# EAGLE board csa_bios_v3.0d (EAGLE 4.15)
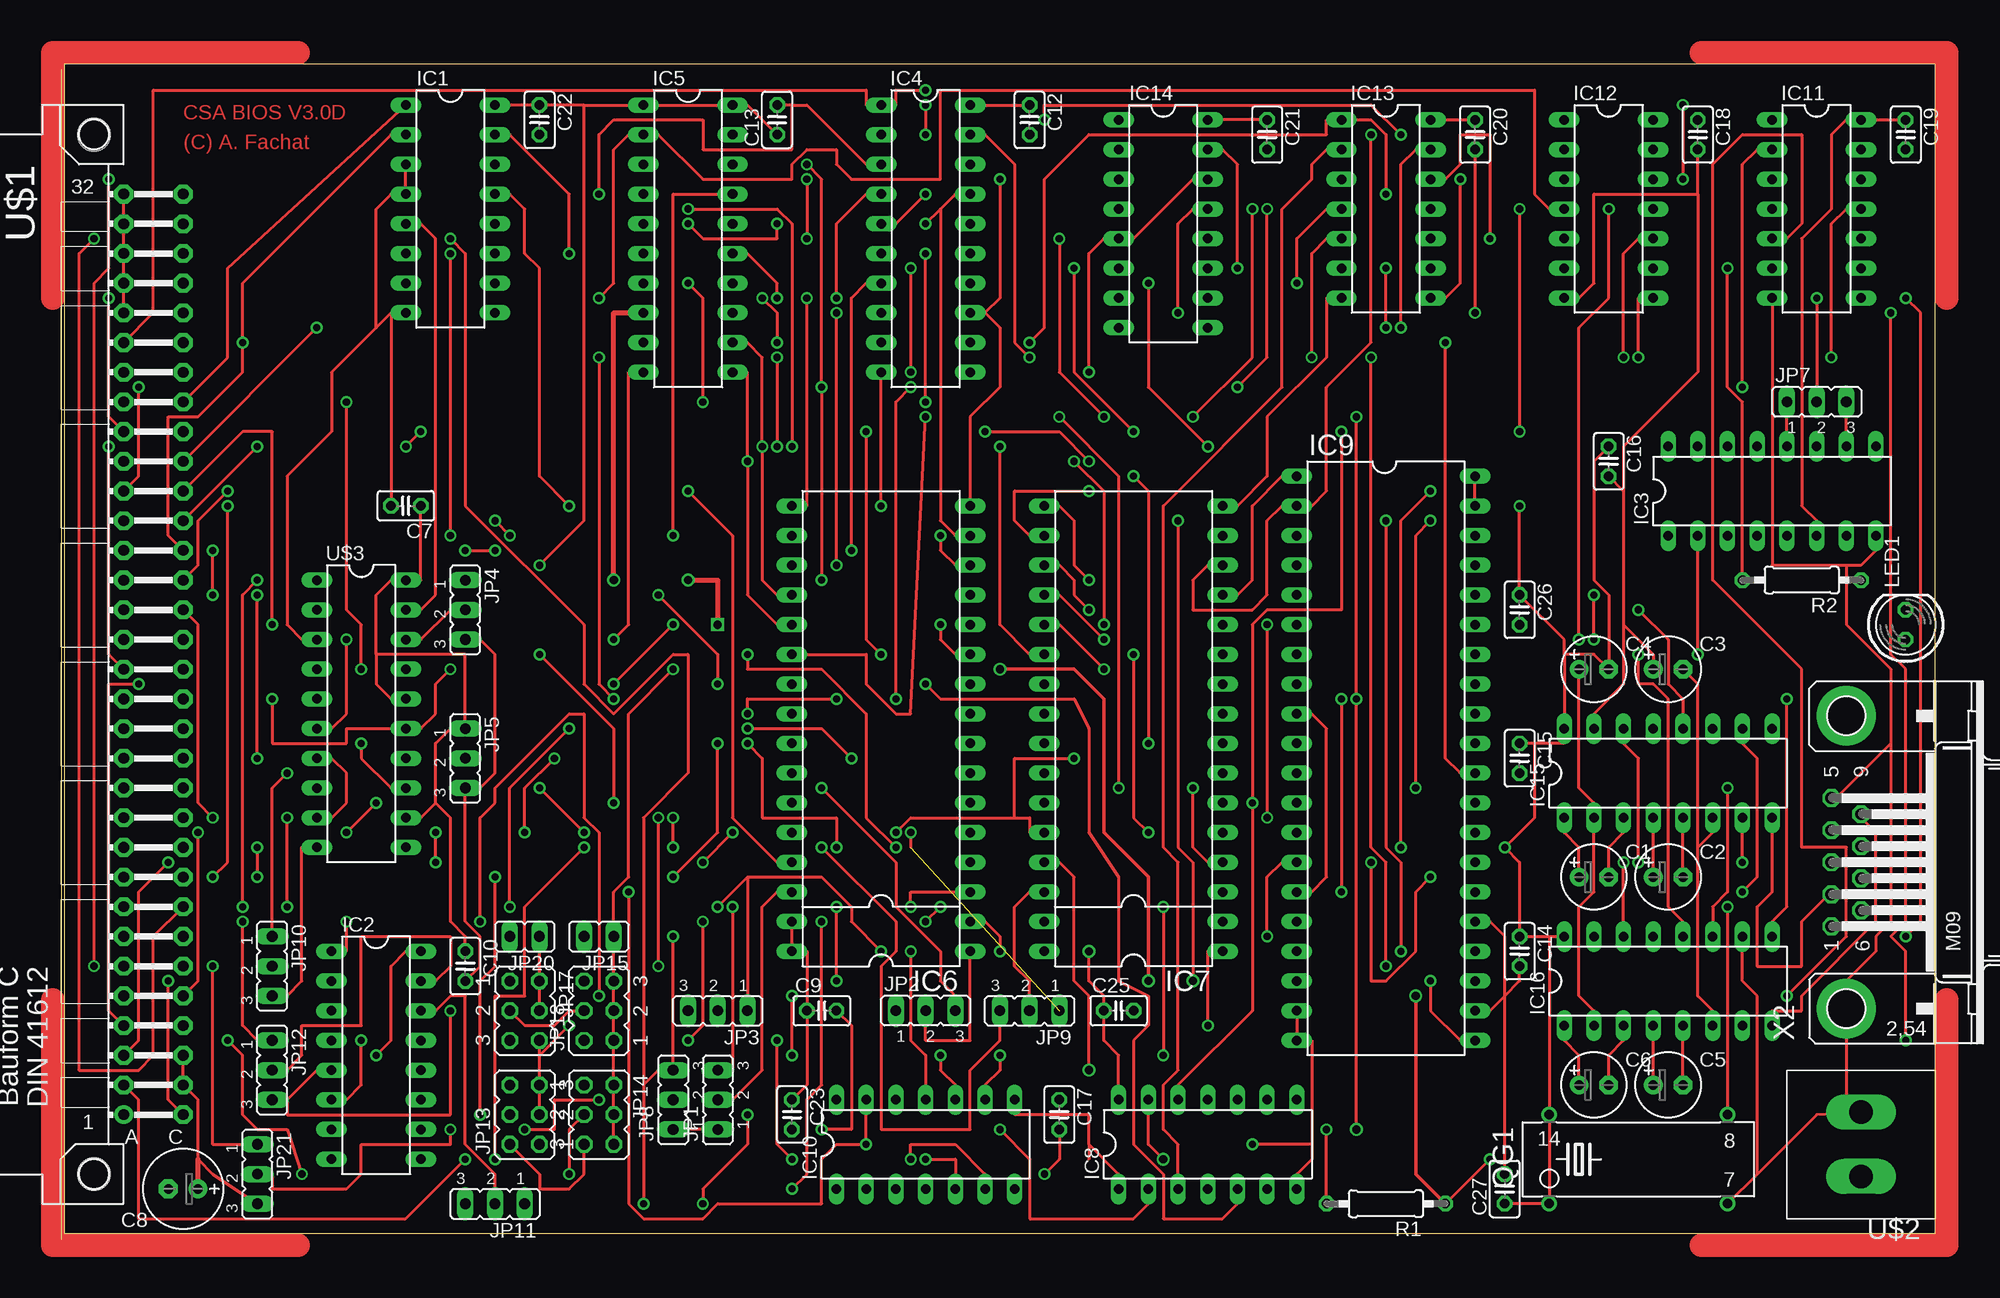
[diagram p2: board, top side]
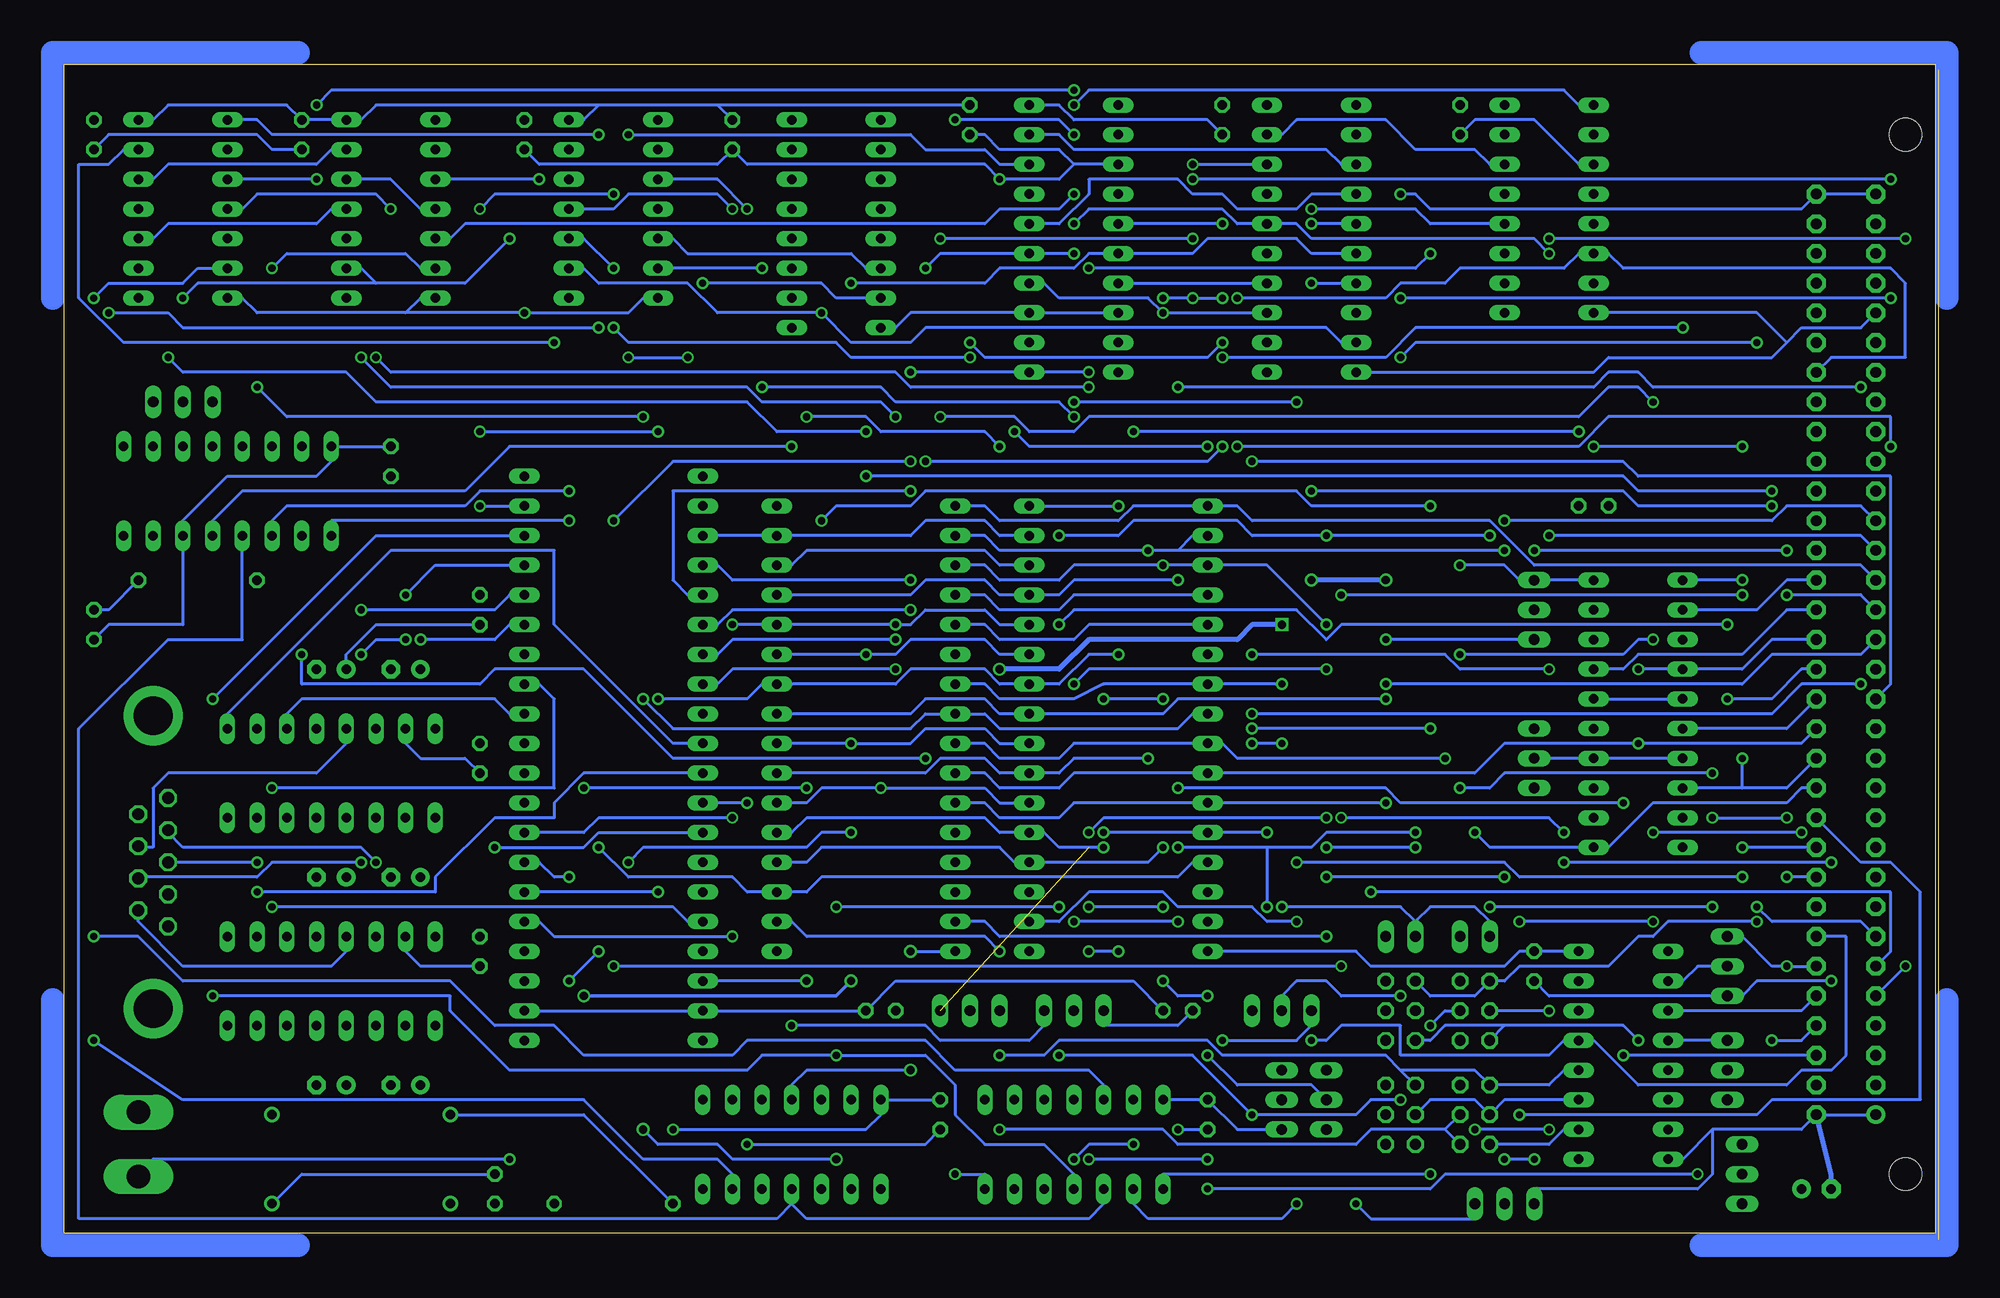
[diagram p3: board, bottom side, seen from below]

Size 160 x 100 mm. Coordinates in mm from the lower left corner, seen from the top.
Outline: 0,0 160,0 160,100 0,100 0,0
Copper layers (1*16): Top 0.035mm / dielectric 1.5mm / Bottom 0.035mm
Design rules "default": minimum track width 10mil, minimum drill 24mil, track to track 8mil, track to pad 8mil, pad to pad 8mil, via to via 8mil, smd to smd 8mil, copper to edge 40mil, drill to drill 8mil, minimum pad ring 10mil, minimum via ring 8mil, stop-mask expansion 4mil, vias tented up to drill 0mil, thermal gap 10mil

## Footprints (pad centres in the part's own frame; a part is rotated, then mirrored left to right if it is on the bottom)
E2,5-6 = drill 0.813 pad 1.6 round: + -1.27,0 | drill 0.813 pad 1.6 octagon: - 1.27,0
C025-025X050 = drill 0.813 octagon: 1 -1.27,0; 2 1.27,0
E2,5-7 = drill 0.813 pad 1.6 round: + -1.27,0 | drill 0.813 pad 1.6 octagon: - 1.27,0
DIL16 = drill 0.813 long: 1 -8.89,-3.81; 2 -6.35,-3.81; 3 -3.81,-3.81; 4 -1.27,-3.81; 5 1.27,-3.81; 6 3.81,-3.81; 7 6.35,-3.81; 8 8.89,-3.81; 9 8.89,3.81; 10 6.35,3.81; 11 3.81,3.81; 12 1.27,3.81; 13 -1.27,3.81; 14 -3.81,3.81; 15 -6.35,3.81; 16 -8.89,3.81
DIL20 = drill 0.813 long: 1 -10.16,-3.81; 2 -7.62,-3.81; 3 -5.08,-3.81; 4 -2.54,-3.81; 5 0,-3.81; 6 2.54,-3.81; 7 5.08,-3.81; 8 7.62,-3.81; 9 10.16,-3.81; 10 12.7,-3.81; 11 12.7,3.81; 12 10.16,3.81; 13 7.62,3.81; 14 5.08,3.81; 15 2.54,3.81; 16 0,3.81; 17 -2.54,3.81; 18 -5.08,3.81; 19 -7.62,3.81; 20 -10.16,3.81
DIL20' = drill 0.813 long: 1 -11.43,-3.81; 2 -8.89,-3.81; 3 -6.35,-3.81; 4 -3.81,-3.81; 5 -1.27,-3.81; 6 1.27,-3.81; 7 3.81,-3.81; 8 6.35,-3.81; 9 8.89,-3.81; 10 11.43,-3.81; 11 11.43,3.81; 12 8.89,3.81; 13 6.35,3.81; 14 3.81,3.81; 15 1.27,3.81; 16 -1.27,3.81; 17 -3.81,3.81; 18 -6.35,3.81; 19 -8.89,3.81; 20 -11.43,3.81
DIL32OPT28 = drill 0.813 long: 1 -19.05,-7.62; 2 -16.51,-7.62; 3 -13.97,-7.62; 4 -11.43,-7.62; 5 -8.89,-7.62; 6 -6.35,-7.62; 7 -3.81,-7.62; 8 -1.27,-7.62; 9 1.27,-7.62; 10 3.81,-7.62; 11 6.35,-7.62; 12 8.89,-7.62; 13 11.43,-7.62; 14 13.97,-7.62; 15 16.51,-7.62; 16 19.05,-7.62; 17 19.05,7.62; 18 16.51,7.62; 19 13.97,7.62; 20 11.43,7.62; 21 8.89,7.62; 22 6.35,7.62; 23 3.81,7.62; 24 1.27,7.62; 25 -1.27,7.62; 26 -3.81,7.62; 27 -6.35,7.62; 28 -8.89,7.62; 29 -11.43,7.62; 30 -13.97,7.62; 31 -16.51,7.62; 32 -19.05,7.62
DIL14 = drill 0.813 long: 1 -7.62,-3.81; 2 -5.08,-3.81; 3 -2.54,-3.81; 4 0,-3.81; 5 2.54,-3.81; 6 5.08,-3.81; 7 7.62,-3.81; 8 7.62,3.81; 9 5.08,3.81; 10 2.54,3.81; 11 0,3.81; 12 -2.54,3.81; 13 -5.08,3.81; 14 -7.62,3.81
DIL40 = drill 0.813 long: 1 -16.51,-7.62; 2 -13.97,-7.62; 3 -11.43,-7.62; 4 -8.89,-7.62; 5 -6.35,-7.62; 6 -3.81,-7.62; 7 -1.27,-7.62; 8 1.27,-7.62; 9 3.81,-7.62; 10 6.35,-7.62; 11 8.89,-7.62; 12 11.43,-7.62; 13 13.97,-7.62; 14 16.51,-7.62; 15 19.05,-7.62; 16 21.59,-7.62; 17 24.13,-7.62; 18 26.67,-7.62; 19 29.21,-7.62; 20 31.75,-7.62; 21 31.75,7.62; 22 29.21,7.62; 23 26.67,7.62; 24 24.13,7.62; 25 21.59,7.62; 26 19.05,7.62; 27 16.51,7.62; 28 13.97,7.62; 29 11.43,7.62; 30 8.89,7.62; 31 6.35,7.62; 32 3.81,7.62; 33 1.27,7.62; 34 -1.27,7.62; 35 -3.81,7.62; 36 -6.35,7.62; 37 -8.89,7.62; 38 -11.43,7.62; 39 -13.97,7.62; 40 -16.51,7.62
JP2 = drill 0.914 long: 1 -2.54,0; 2 0,0; 3 2.54,0
JP3Q = drill 0.914 octagon: 1 -2.54,-1.27; 2 -2.54,1.27; 3 0,-1.27; 4 0,1.27; 5 2.54,-1.27; 6 2.54,1.27
JP1 = drill 0.914 long: 1 0,-1.27; 2 0,1.27
LED5MM = drill 0.813 octagon: A -1.27,0; K 1.27,0
SG51 = drill 0.813 round: 1 -7.62,-3.81; 7 7.62,-3.81; 8 7.62,3.81; 14 -7.62,3.81
0207/10 = drill 0.813 octagon: 1 -5.08,0; 2 5.08,0
CSABUS = drill 0.914 pad 1.6 round: A1 7.62,36.83 | drill 0.914 pad 1.6 octagon: A2 7.62,34.29; A3 7.62,31.75; A4 7.62,29.21; A5 7.62,26.67; A6 7.62,24.13; A7 7.62,21.59; A8 7.62,19.05; A9 7.62,16.51; A10 7.62,13.97; A11 7.62,11.43; A12 7.62,8.89; A13 7.62,6.35; A14 7.62,3.81; A15 7.62,1.27; A16 7.62,-1.27; A17 7.62,-3.81; A18 7.62,-6.35; A19 7.62,-8.89; A20 7.62,-11.43; A21 7.62,-13.97; A22 7.62,-16.51; A23 7.62,-19.05; A24 7.62,-21.59; A25 7.62,-24.13; A26 7.62,-26.67; A27 7.62,-29.21; A28 7.62,-31.75; A29 7.62,-34.29; A30 7.62,-36.83; A31 7.62,-39.37; A32 7.62,-41.91; C1 2.54,36.83; C2 2.54,34.29; C3 2.54,31.75; C4 2.54,29.21; C5 2.54,26.67; C6 2.54,24.13; C7 2.54,21.59; C8 2.54,19.05; C9 2.54,16.51; C10 2.54,13.97; C11 2.54,11.43; C12 2.54,8.89; C13 2.54,6.35; C14 2.54,3.81; C15 2.54,1.27; C16 2.54,-1.27; C17 2.54,-3.81; C18 2.54,-6.35; C19 2.54,-8.89; C20 2.54,-11.43; C21 2.54,-13.97; C22 2.54,-16.51; C23 2.54,-19.05; C24 2.54,-21.59; C25 2.54,-24.13; C26 2.54,-26.67; C27 2.54,-29.21; C28 2.54,-31.75; C29 2.54,-34.29; C30 2.54,-36.83; C31 2.54,-39.37; C32 2.54,-41.91 | hole 2.794: 10.16,41.91; 10.16,-46.99
TASTER = drill 2.007 long: 1 0,4.013; 3 0,-1.473
M09HP = drill 1.016 octagon: 1 -5.486,1.27; 2 -2.743,1.27; 3 0,1.27; 4 2.743,1.27; 5 5.486,1.27; 6 -4.115,-1.27; 7 -1.372,-1.27; 8 1.372,-1.27; 9 4.115,-1.27 | drill 3.302 pad 5.08 round: G1 -12.522,0; G2 12.522,0

## Placement (x,y rotation side)
C1  1u  [E2,5-6]  130.81,30.48 0 top
C2  1u  [E2,5-6]  137.16,30.48 0 top
C3  4u7  [E2,5-6]  137.16,48.26 0 top
C4  4u7  [E2,5-6]  130.81,48.26 0 top
C5  1u  [E2,5-6]  137.16,12.7 0 top
C6  1u  [E2,5-6]  130.81,12.7 0 top
C7  [C025-025X050]  29.21,62.23 180 top
C8  47u  [E2,5-7]  10.16,3.81 180 top
C9  [C025-025X050]  64.77,19.05 0 top
C10  [C025-025X050]  34.29,22.86 270 top
C12  [C025-025X050]  82.55,95.25 270 top
C13  [C025-025X050]  60.96,95.25 90 top
C14  [C025-025X050]  124.46,24.13 270 top
C15  [C025-025X050]  124.46,40.64 270 top
C16  [C025-025X050]  132.08,66.04 270 top
C17  [C025-025X050]  85.09,10.16 270 top
C18  [C025-025X050]  139.7,93.98 270 top
C19  [C025-025X050]  157.48,93.98 270 top
C20  [C025-025X050]  120.65,93.98 270 top
C21  [C025-025X050]  102.87,93.98 270 top
C22  [C025-025X050]  40.64,95.25 270 top
C23  [C025-025X050]  62.23,10.16 270 top
C25  [C025-025X050]  90.17,19.05 0 top
C26  [C025-025X050]  124.46,53.34 270 top
C27  [C025-025X050]  123.19,3.81 90 top
IC1  74HC138N  [DIL16]  33.02,87.63 270 top
IC2  74LS139N  [DIL16]  26.67,15.24 270 top
IC3  74HC138N  [DIL16]  146.05,63.5 0 top
IC4  74LS273BUSOPT  [DIL20]  73.66,86.36 270 top
IC5  74HCT245N  [DIL20']  53.34,85.09 270 top
IC6  ROMSOCK32TO512K  [DIL32OPT28]  69.85,43.18 90 top
IC7  RAMSOCK32TO512K  [DIL32OPT28]  91.44,43.18 90 top
IC8  74HCT00N  [DIL14]  97.79,7.62 0 top
IC9  UART  [DIL40]  113.03,48.26 270 top
IC10  74LS32N  [DIL14]  73.66,7.62 0 top
IC11  74LS04N  [DIL14]  149.86,87.63 270 top
IC12  74LS07N  [DIL14]  132.08,87.63 270 top
IC13  74HCT00N  [DIL14]  113.03,87.63 270 top
IC14  74LS279N  [DIL16]  93.98,86.36 270 top
IC15  MAX232  [DIL16]  137.16,39.37 0 top
IC16  MAX232  [DIL16]  137.16,21.59 0 top
JP1  [JP2]  55.88,11.43 90 top
JP2  [JP2]  73.66,19.05 0 top
JP3  [JP2]  55.88,19.05 180 top
JP4  [JP2]  34.29,53.34 270 top
JP5  [JP2]  34.29,40.64 270 top
JP7  [JP2]  149.86,71.12 0 top
JP8  [JP2]  52.07,11.43 90 top
JP9  [JP2]  82.55,19.05 180 top
JP10  [JP2]  17.78,22.86 270 top
JP11  [JP2]  36.83,2.54 180 top
JP12  [JP2]  17.78,13.97 270 top
JP13  [JP3Q]  39.37,10.16 90 top
JP14  [JP3Q]  45.72,10.16 270 top
JP15  [JP1]  45.72,25.4 90 top
JP17  [JP3Q]  39.37,19.05 270 top
JP18  [JP3Q]  45.72,19.05 90 top
JP20  [JP1]  39.37,25.4 90 top
JP21  [JP2]  16.51,5.08 270 top
LED1  [LED5MM]  157.48,52.07 90 top
QG1  1,8432MHz  [SG51]  134.62,6.35 0 top
R1  4k7  [0207/10]  113.03,2.54 180 top
R2  220  [0207/10]  148.59,55.88 180 top
U$1  CSABUS  [CSABUS]  12.7,46.99 180 top
U$2  TASTER  [TASTER]  153.67,8.89 180 top
U$3  74LS688BUSOPT  [DIL20]  25.4,45.72 270 top
X2  [M09HP]  152.4,31.75 90 top

## Tracks (layer width: path | path; a pad name or v marks a point on that pad's centre or on a via)
50HZ  (via drill 0.61)
  Top 0.254: U$1.A3 6.35,16.51 6.35,29.21 v8.89,31.75 | v31.75,31.75 v31.75,34.29 | v50.8,35.56 v50.8,22.86 | v113.03,22.86 113.03,31.75 111.76,33.02 v111.76,74.93 | v106.68,74.93 106.68,83.82 107.95,85.09 IC13.5
  Bottom 0.254: IC14.6 91.44,82.55 92.71,83.82 106.68,83.82 107.95,85.09 IC13.5 | v8.89,31.75 v31.75,31.75 | v31.75,34.29 33.02,35.56 v50.8,35.56 | v50.8,22.86 v113.03,22.86 | v111.76,74.93 v106.68,74.93
/CTRLR
  Bottom 0.254: IC1.14 38.1,91.44 39.37,92.71 44.45,92.71 46.99,95.25 54.61,95.25 55.88,93.98 IC5.19
/CTRLW  (via drill 0.61)
  Top 0.254: IC14.14 96.52,90.17 91.44,85.09 IC14.5 88.9,85.09 87.63,83.82 v87.63,73.66 | v43.18,83.82 43.18,88.9 38.1,93.98 IC1.15 | v72.39,82.55 v72.39,73.66
  Bottom 0.254: v43.18,83.82 44.45,82.55 v72.39,82.55 | v72.39,73.66 IC4.11 v87.63,73.66
/EXTIO  (via drill 0.61)
  Top 0.254: v134.62,74.93 134.62,80.01 IC12.8 | v88.9,69.85 85.09,73.66 v85.09,85.09 | v63.5,90.17 v63.5,85.09 | v2.54,22.86 2.54,81.28 3.81,82.55 v3.81,90.17
  Bottom 0.254: v134.62,74.93 132.08,72.39 101.6,72.39 100.33,71.12 90.17,71.12 v88.9,69.85 | v63.5,85.09 v85.09,85.09 | v3.81,90.17 v63.5,90.17 | U$1.A5 v2.54,22.86
/EXTIOEN  (via drill 0.61)
  Top 0.254: v97.79,67.31 92.71,72.39 v92.71,81.28
  Bottom 0.254: IC5.6 53.34,83.82 54.61,85.09 62.23,85.09 63.5,83.82 IC4.6 72.39,83.82 73.66,82.55 80.01,82.55 81.28,81.28 v92.71,81.28 | v97.79,67.31 121.92,67.31 125.73,63.5 144.78,63.5 147.32,60.96 IC3.5
/IOINH  (via drill 0.61)
  Top 0.254: v133.35,74.93 133.35,83.82 134.62,85.09 IC12.10 | v72.39,72.39 71.12,71.12 v71.12,45.72 | v66.04,45.72 58.42,45.72 v58.42,44.45 | v6.35,46.99 3.81,46.99 3.81,19.05 U$1.A4
  Bottom 0.254: v133.35,74.93 132.08,73.66 88.9,73.66 87.63,72.39 v72.39,72.39 | v66.04,45.72 v71.12,45.72 | v58.42,44.45 13.97,44.45 11.43,46.99 v6.35,46.99
/IOSEL  (via drill 0.61)
  Top 0.254: v16.51,55.88 15.24,54.61 v15.24,27.94
  Bottom 0.254: v15.24,27.94 13.97,26.67 6.35,26.67 U$1.A7 | v16.51,55.88 U$3.1
/IRQ  (via drill 0.61)
  Top 0.254: IC12.4 127,87.63 125.73,88.9 125.73,97.79 74.93,97.79 74.93,90.17 67.31,90.17 66.04,91.44 66.04,92.71 63.5,92.71 62.23,91.44 62.23,90.17 54.61,90.17 50.8,93.98 IC5.2 48.26,93.98 46.99,92.71 46.99,81.28 v45.72,80.01 | U$1.A24 3.81,69.85 v3.81,80.01
  Bottom 0.254: IC12.12 132.08,90.17 129.54,87.63 IC12.4 | v3.81,80.01 v45.72,80.01
/MEMSEL  (via drill 0.61)
  Top 0.254: v73.66,6.35 76.2,6.35 IC10.5 | IC10.13 v68.58,7.62 66.04,7.62 64.77,6.35 64.77,2.54 55.88,2.54 54.61,1.27 49.53,1.27 48.26,2.54 v48.26,29.21
  Bottom 0.254: v68.58,7.62 72.39,7.62 v73.66,6.35 | U$1.A6 3.81,24.13 3.81,29.21 v48.26,29.21
/RAM  (via drill 0.61)
  Top 0.254: JP17.4 JP17.2 JP20.1 | v80.01,8.89 82.55,6.35 82.55,1.27 91.44,1.27 92.71,2.54 IC8.2 | JP13.3 JP13.5 40.64,15.24 | 40.64,15.24 JP17.6 | 40.64,15.24 v43.18,17.78
  Bottom 0.254: v80.01,8.89 66.04,8.89 64.77,7.62 49.53,7.62 48.26,8.89 41.91,8.89 | 41.91,8.89 JP13.3 | JP13.1 41.91,8.89 | JP17.4 41.91,19.05 v43.18,17.78
/RAMSEL  (via drill 0.61)
  Top 0.254: v73.66,69.85 72.39,44.45 71.12,44.45 68.58,46.99 68.58,49.53 IC6.22 | v100.33,72.39 102.87,74.93 v102.87,87.63
  Bottom 0.254: v73.66,69.85 74.93,71.12 88.9,71.12 90.17,72.39 v100.33,72.39 | v102.87,87.63 104.14,88.9 111.76,88.9 113.03,87.63 IC13.11
/RES  (via drill 0.61)
  Top 0.254: v138.43,96.52 v138.43,90.17 | v73.66,97.79 71.12,97.79 71.12,96.52 IC4.1 68.58,96.52 68.58,97.79 7.62,97.79 7.62,78.74 U$1.A27
  Bottom 0.254: v138.43,96.52 137.16,97.79 v73.66,97.79 | v138.43,90.17 IC11.3
/ROM  (via drill 0.61)
  Top 0.254: JP14.6 JP14.4 JP14.2 JP18.1 JP18.3 JP18.5 JP15.1 46.99,29.21 48.26,30.48 48.26,44.45 v52.07,48.26 | v73.66,46.99 74.93,45.72 86.36,45.72 87.63,43.18 87.63,34.29 90.17,30.48 90.17,21.59 92.71,20.32 92.71,17.78 91.44,16.51 91.44,7.62 93.98,5.08 93.98,1.27 99.06,1.27 100.33,2.54 IC8.5
  Bottom 0.254: v73.66,46.99 72.39,48.26 v52.07,48.26
/UARTRD  (via drill 0.61)
  Top 0.254: v116.84,21.59 116.84,19.05 119.38,16.51 IC9.21 | v113.03,60.96 113.03,33.02 114.3,31.75 v114.3,24.13 | v87.63,66.04 85.09,68.58 v78.74,68.58 | v62.23,67.31 62.23,86.36 60.96,87.63 v53.34,87.63
  Bottom 0.254: v114.3,24.13 v116.84,21.59 | v113.03,60.96 107.95,66.04 v87.63,66.04 | v78.74,68.58 77.47,67.31 v62.23,67.31 | v53.34,87.63 44.45,87.63 43.18,86.36 IC1.12
/UARTWR  (via drill 0.61, 0.7)
  Top 0.254: v96.52,21.59 96.52,31.75 95.25,33.02 v95.25,60.96 | v43.18,62.23 40.64,64.77 40.64,82.55 39.37,83.82 39.37,87.63 38.1,88.9 IC1.13
  Bottom 0.254: v95.25,60.96 93.98,62.23 87.63,62.23 86.36,63.5 54.61,63.5 53.34,62.23 v43.18,62.23 | v96.52,21.59 IC9.18
BUSA0  (via drill 0.61)
  Top 0.254: v102.87,52.07 v102.87,35.56 | U$1.C23 v21.59,77.47 | v60.96,74.93 v60.96,67.31 | v86.36,66.04 88.9,63.5 v88.9,52.07
  Bottom 0.254: IC6.12 80.01,52.07 81.28,53.34 86.36,53.34 87.63,52.07 v88.9,52.07 IC7.12 v102.87,52.07 | v102.87,35.56 114.3,35.56 115.57,34.29 IC9.28 | v21.59,77.47 44.45,77.47 46.99,74.93 v60.96,74.93 | v60.96,67.31 62.23,66.04 v86.36,66.04
BUSA1  (via drill 0.61)
  Top 0.254: v116.84,30.48 115.57,29.21 115.57,24.13 113.03,21.59 111.76,21.59 v111.76,31.75 | v92.71,34.29 91.44,35.56 v91.44,49.53 | U$1.C22 15.24,68.58 17.78,68.58 v17.78,52.07 | v74.93,52.07 74.93,50.8 76.2,49.53 IC6.11
  Bottom 0.254: IC6.11 80.01,49.53 81.28,50.8 87.63,50.8 88.9,49.53 v91.44,49.53 IC7.11 | v116.84,30.48 118.11,30.48 119.38,31.75 IC9.27 | v111.76,31.75 110.49,33.02 96.52,33.02 95.25,34.29 v92.71,34.29 | v17.78,52.07 50.8,52.07 52.07,50.8 54.61,53.34 73.66,53.34 v74.93,52.07
BUSA2  (via drill 0.61)
  Top 0.254: v109.22,45.72 v109.22,29.21 | U$1.C21 v16.51,67.31 | v29.21,67.31 v30.48,68.58 | v68.58,68.58 68.58,50.8 v69.85,49.53
  Bottom 0.254: v109.22,45.72 101.6,45.72 100.33,46.99 IC7.10 88.9,46.99 87.63,48.26 81.28,48.26 80.01,46.99 IC6.10 74.93,46.99 72.39,49.53 v69.85,49.53 | v109.22,29.21 IC9.26 | v16.51,67.31 v29.21,67.31 | v30.48,68.58 v68.58,68.58
BUSA3  (via drill 0.61)
  Top 0.254: U$1.C20 8.89,59.69 8.89,69.85 11.43,69.85 15.24,73.66 v15.24,76.2 15.24,81.28 27.94,93.98 IC1.2 | v46.99,45.72 45.72,46.99 v45.72,74.93
  Bottom 0.254: IC7.9 87.63,44.45 86.36,45.72 81.28,45.72 80.01,44.45 IC6.9 66.04,44.45 64.77,45.72 v46.99,45.72 | v45.72,74.93 44.45,76.2 v15.24,76.2
BUSA4  (via drill 0.61)
  Top 0.254: U$1.C19 11.43,57.15 11.43,60.96 v13.97,63.5 | v91.44,64.77 92.71,63.5 v92.71,41.91
  Bottom 0.254: U$1.C19 12.7,55.88 15.24,53.34 U$3.2 | IC6.8 80.01,41.91 81.28,43.18 86.36,43.18 87.63,41.91 v92.71,41.91 IC7.8 | v13.97,63.5 25.4,63.5 26.67,64.77 v91.44,64.77
BUSA5  (via drill 0.61)
  Top 0.254: v67.31,40.64 64.77,43.18 v58.42,43.18 | v43.18,43.18 38.1,38.1 v38.1,27.94 | v19.05,27.94 v19.05,35.56 | v12.7,35.56 11.43,36.83 11.43,52.07 U$1.C18
  Bottom 0.254: IC7.7 86.36,39.37 85.09,40.64 81.28,40.64 80.01,39.37 IC6.7 74.93,39.37 73.66,40.64 v67.31,40.64 | U$1.C18 12.7,53.34 16.51,49.53 25.4,49.53 26.67,48.26 U$3.17 | v43.18,43.18 v58.42,43.18 | v19.05,27.94 v38.1,27.94 | v19.05,35.56 v12.7,35.56
BUSA6  (via drill 0.61)
  Top 0.254: v25.4,48.26 25.4,52.07 24.13,53.34 v24.13,71.12 | v85.09,69.85 90.17,64.77 v90.17,38.1
  Bottom 0.254: U$1.C17 13.97,50.8 16.51,48.26 U$3.4 v25.4,48.26 | IC6.6 80.01,36.83 81.28,38.1 v90.17,38.1 95.25,38.1 96.52,36.83 IC7.6 | v24.13,71.12 25.4,72.39 27.94,72.39 30.48,69.85 72.39,69.85 73.66,68.58 77.47,68.58 78.74,69.85 v85.09,69.85
BUSA7  (via drill 0.61)
  Top 0.254: v17.78,45.72 17.78,41.91 24.13,41.91 24.13,43.18 U$3.15 30.48,43.18 31.75,44.45 31.75,46.99 v33.02,48.26 | v71.12,33.02 68.58,35.56 68.58,44.45 64.77,48.26 58.42,48.26 v58.42,49.53
  Bottom 0.254: IC7.5 97.79,34.29 96.52,35.56 81.28,35.56 80.01,34.29 IC6.5 76.2,34.29 74.93,33.02 v71.12,33.02 | v17.78,45.72 13.97,45.72 11.43,48.26 U$1.C16 | v58.42,49.53 41.91,49.53 40.64,48.26 v33.02,48.26
BUSA8  (via drill 0.61)
  Top 0.254: v24.13,50.8 24.13,44.45 22.86,43.18 U$3.6 | v40.64,49.53 46.99,43.18 v46.99,36.83
  Bottom 0.254: U$1.C15 12.7,43.18 U$3.6 | IC7.27 81.28,36.83 80.01,35.56 74.93,35.56 73.66,36.83 IC6.27 v46.99,36.83 | v24.13,50.8 25.4,50.8 26.67,49.53 v40.64,49.53
BUSA9  (via drill 0.61)
  Top 0.254: v25.4,41.91 25.4,40.64 27.94,38.1 U$3.13
  Bottom 0.254: IC7.26 81.28,39.37 80.01,38.1 74.93,38.1 73.66,39.37 IC6.26 39.37,39.37 36.83,41.91 v25.4,41.91 11.43,41.91 U$1.C14
BUSA10  (via drill 0.61)
  Top 0.254: v16.51,40.64 v16.51,54.61 | v50.8,54.61 55.88,49.53 v55.88,46.99
  Bottom 0.254: 16.51,38.1 12.7,38.1 U$1.C13 | 16.51,38.1 U$3.8 | IC7.23 81.28,46.99 80.01,45.72 73.66,45.72 71.12,46.99 IC6.23 v55.88,46.99 | 16.51,38.1 v16.51,40.64 | v16.51,54.61 v50.8,54.61
BUSA11  (via drill 0.61)
  Top 0.254: v41.91,40.64 39.37,38.1 v39.37,34.29
  Bottom 0.254: IC7.25 81.28,41.91 80.01,40.64 74.93,40.64 73.66,41.91 IC6.25 60.96,41.91 59.69,40.64 v41.91,40.64 | U$1.C12 11.43,38.1 12.7,36.83 24.13,36.83 27.94,33.02 U$3.11 38.1,33.02 v39.37,34.29
BUSA12  (via drill 0.61)
  Top 0.254: v116.84,60.96 115.57,59.69 v115.57,38.1 | v96.52,38.1 96.52,33.02 97.79,31.75 IC7.4 | v35.56,10.16 35.56,21.59 36.83,22.86 v36.83,30.48 | v52.07,30.48 55.88,34.29 v55.88,41.91 | v58.42,41.91 59.69,40.64 59.69,35.56 66.04,35.56 v66.04,33.02
  Bottom 0.254: IC7.4 96.52,31.75 95.25,33.02 80.01,33.02 78.74,31.75 IC6.4 67.31,31.75 v66.04,33.02 | v116.84,60.96 137.16,60.96 IC3.1 | v96.52,38.1 v115.57,38.1 | U$1.C11 6.35,31.75 3.81,31.75 1.27,29.21 1.27,11.43 13.97,11.43 15.24,10.16 v35.56,10.16 | v36.83,30.48 v52.07,30.48 | v55.88,41.91 v58.42,41.91
BUSA13  (via drill 0.61)
  Top 0.254: v71.12,34.29 72.39,35.56 81.28,35.56 | 81.28,35.56 82.55,35.56 82.55,34.29 IC7.28 | v86.36,40.64 81.28,40.64 81.28,35.56 | v139.7,49.53 IC3.2 | v16.51,33.02 v16.51,30.48 | v54.61,31.75 v57.15,34.29
  Bottom 0.254: v71.12,34.29 IC6.28 v57.15,34.29 | v139.7,49.53 139.7,46.99 124.46,46.99 123.19,48.26 115.57,48.26 107.95,40.64 v86.36,40.64 | U$1.C10 v16.51,33.02 | v16.51,30.48 35.56,30.48 36.83,31.75 v54.61,31.75
BUSA14  (via drill 0.61)
  Top 0.254: v116.84,63.5 114.3,60.96 v114.3,33.02 | v12.7,30.48 13.97,31.75 v13.97,62.23 | v53.34,63.5 57.15,59.69 57.15,35.56 60.96,31.75 IC6.29
  Bottom 0.254: IC6.29 63.5,31.75 64.77,30.48 95.25,30.48 96.52,29.21 IC7.3 101.6,29.21 102.87,30.48 111.76,30.48 v114.3,33.02 | v116.84,63.5 124.46,63.5 125.73,62.23 140.97,62.23 142.24,60.96 IC3.3 | U$1.C9 v12.7,30.48 | v13.97,62.23 25.4,62.23 26.67,63.5 v53.34,63.5
BUSA15  (via drill 0.61)
  Top 0.254: v52.07,25.4 JP8.3 50.8,13.97 49.53,12.7 | 49.53,12.7 v49.53,2.54 | U$1.C8 7.62,25.4 7.62,15.24 6.35,13.97 1.27,13.97 1.27,83.82 v2.54,85.09 | v33.02,85.09 34.29,83.82 34.29,62.23 44.45,52.07 44.45,46.99 46.99,44.45 52.07,49.53 53.34,49.53 53.34,39.37 49.53,35.56 49.53,12.7
  Bottom 0.254: v52.07,25.4 80.01,25.4 81.28,26.67 IC7.31 | v49.53,2.54 48.26,1.27 39.37,1.27 JP11.1 | v2.54,85.09 v33.02,85.09
BUSA16  (via drill 0.61)
  Top 0.254: v80.01,24.13 80.01,25.4 78.74,26.67 IC6.2 | v54.61,26.67 54.61,17.78 v53.34,16.51
  Bottom 0.254: U$1.C7 7.62,25.4 7.62,15.24 8.89,13.97 11.43,13.97 12.7,12.7 25.4,12.7 29.21,16.51 IC2.13 31.75,16.51 33.02,15.24 45.72,15.24 45.72,17.78 50.8,17.78 52.07,16.51 v53.34,16.51 | v80.01,24.13 81.28,25.4 96.52,25.4 97.79,26.67 IC7.2 | v54.61,26.67 57.15,26.67 58.42,27.94 64.77,27.94 66.04,29.21 72.39,29.21 74.93,26.67 IC6.2
BUSA17  (via drill 0.61)
  Top 0.254: JP9.3 80.01,16.51 77.47,13.97 77.47,8.89 69.85,8.89 69.85,22.86 71.12,24.13 71.12,26.67 v64.77,33.02 | v12.7,22.86 12.7,7.62 JP21.1 | v40.64,38.1 v44.45,34.29 | v19.05,39.37 17.78,38.1 JP10.1 | v57.15,27.94 57.15,13.97 JP1.3
  Bottom 0.254: U$1.C6 v12.7,22.86 13.97,22.86 16.51,25.4 JP10.1 | 57.15,33.02 53.34,33.02 52.07,34.29 v44.45,34.29 | 57.15,33.02 v64.77,33.02 | v40.64,38.1 38.1,38.1 36.83,39.37 v19.05,39.37 | 57.15,33.02 v57.15,27.94
BUSA17X  (via drill 0.61)
  Top 0.254: v54.61,2.54 54.61,3.81 58.42,7.62 v58.42,10.16 | v45.72,11.43 41.91,11.43 41.91,8.89 v39.37,8.89 | v33.02,8.89 33.02,7.62 25.4,7.62 25.4,5.08 24.13,3.81 17.78,3.81 17.78,5.08 JP21.2 | v74.93,15.24 74.93,13.97 76.2,12.7 IC10.10
  Bottom 0.254: v54.61,2.54 55.88,1.27 67.31,1.27 68.58,2.54 IC10.2 | v45.72,11.43 48.26,11.43 49.53,10.16 v58.42,10.16 63.5,15.24 v74.93,15.24 | v33.02,8.89 v39.37,8.89
BUSA18  (via drill 0.61)
  Top 0.254: v97.79,17.78 97.79,24.13 IC7.1 | U$1.C5 11.43,21.59 v11.43,34.29 | v24.13,34.29 v26.67,36.83 | v64.77,38.1 71.12,31.75 71.12,27.94 74.93,24.13 74.93,21.59 76.2,20.32 JP2.3
  Bottom 0.254: U$1.C5 11.43,19.05 IC2.3 | v97.79,17.78 86.36,17.78 85.09,16.51 77.47,16.51 76.2,17.78 JP2.3 | v11.43,34.29 v24.13,34.29 | v26.67,36.83 45.72,36.83 46.99,38.1 v64.77,38.1
BUSA19  (via drill 0.61)
  Top 0.254: v147.32,20.32 152.4,25.4 152.4,33.02 148.59,33.02 148.59,48.26 140.97,55.88 140.97,91.44 143.51,93.98 148.59,93.98 148.59,86.36 147.32,85.09 IC11.5 | v13.97,16.51 15.24,15.24 15.24,10.16 16.51,8.89 19.05,8.89 v20.32,5.08 | v62.23,3.81 63.5,5.08 63.5,11.43 64.77,12.7 v64.77,26.67 | v73.66,26.67 v74.93,27.94 | v93.98,27.94 v93.98,15.24
  Bottom 0.254: v147.32,20.32 127,20.32 127,19.05 121.92,13.97 101.6,13.97 100.33,15.24 v93.98,15.24 86.36,15.24 83.82,12.7 83.82,10.16 81.28,7.62 76.2,7.62 73.66,5.08 IC10.4 | U$1.C4 11.43,16.51 v13.97,16.51 | v20.32,5.08 41.91,5.08 43.18,3.81 v62.23,3.81 | v64.77,26.67 v73.66,26.67 | v74.93,27.94 v93.98,27.94
BUSD0  (via drill 0.61)
  Top 0.254: v63.5,91.44 64.77,90.17 v64.77,72.39 v64.77,55.88 | IC9.1 104.14,64.77 101.6,62.23 101.6,55.88 100.33,54.61 IC7.13 | U$1.A22 6.35,64.77 v6.35,72.39
  Bottom 0.254: IC7.13 87.63,54.61 86.36,55.88 81.28,55.88 80.01,54.61 IC6.13 74.93,54.61 73.66,55.88 v64.77,55.88 | v63.5,91.44 IC5.18 | v6.35,72.39 24.13,72.39 25.4,73.66 27.94,73.66 29.21,72.39 v64.77,72.39
BUSD1  (via drill 0.61)
  Top 0.254: IC7.14 97.79,57.15 96.52,55.88 96.52,53.34 101.6,53.34 102.87,54.61 102.87,60.96 104.14,62.23 IC9.2 106.68,62.23 107.95,63.5 107.95,72.39 111.76,76.2 v111.76,93.98 | v52.07,59.69 52.07,88.9 IC5.17 | v74.93,59.69 74.93,58.42 76.2,57.15 IC6.14 | v36.83,60.96 v38.1,59.69
  Bottom 0.254: IC6.14 80.01,57.15 81.28,58.42 96.52,58.42 97.79,57.15 IC7.14 | v74.93,59.69 69.85,59.69 68.58,60.96 59.69,60.96 58.42,59.69 v52.07,59.69 v38.1,59.69 | v111.76,93.98 87.63,93.98 86.36,92.71 81.28,92.71 80.01,91.44 IC4.18 | U$1.A21 6.35,62.23 12.7,62.23 13.97,60.96 v36.83,60.96
BUSD2  (via drill 0.61)
  Top 0.254: 74.93,87.63 76.2,88.9 IC4.17 | v73.66,86.36 74.93,87.63 | 74.93,87.63 74.93,60.96 76.2,59.69 IC6.15 | v33.02,59.69 v33.02,83.82
  Bottom 0.254: IC9.3 IC7.15 87.63,59.69 86.36,60.96 81.28,60.96 80.01,59.69 IC6.15 | v73.66,86.36 72.39,87.63 60.96,87.63 59.69,86.36 IC5.16 54.61,86.36 53.34,85.09 34.29,85.09 v33.02,83.82 | U$1.A20 6.35,59.69 v33.02,59.69
BUSD3  (via drill 0.61)
  Top 0.254: v87.63,55.88 86.36,57.15 86.36,60.96 85.09,62.23 IC7.17 | v60.96,80.01 60.96,81.28 58.42,83.82 IC5.15 | v63.5,80.01 63.5,62.23 IC6.17 | v66.04,80.01 66.04,86.36 68.58,88.9 IC4.4
  Bottom 0.254: IC7.17 81.28,62.23 80.01,60.96 69.85,60.96 68.58,62.23 IC6.17 59.69,62.23 58.42,60.96 38.1,60.96 34.29,57.15 6.35,57.15 U$1.A19 | v87.63,55.88 102.87,55.88 104.14,57.15 IC9.4 | v60.96,80.01 v63.5,80.01 v66.04,80.01
BUSD4  (via drill 0.61)
  Top 0.254: v87.63,63.5 81.28,63.5 81.28,60.96 82.55,59.69 IC7.18 | v12.7,54.61 v12.7,58.42 | v34.29,58.42 v36.83,58.42 | v67.31,58.42 67.31,80.01 68.58,81.28 IC4.7
  Bottom 0.254: IC4.7 IC5.14 | 64.77,58.42 63.5,59.69 IC6.18 | 64.77,58.42 v67.31,58.42 80.01,58.42 81.28,59.69 IC7.18 | v87.63,63.5 107.95,63.5 107.95,55.88 106.68,54.61 IC9.5 | U$1.A18 6.35,54.61 v12.7,54.61 | v12.7,58.42 v34.29,58.42 | v36.83,58.42 64.77,58.42
BUSD5  (via drill 0.61)
  Top 0.254: v87.63,53.34 86.36,54.61 86.36,55.88 85.09,57.15 IC7.19 | v46.99,46.99 v52.07,52.07 | v66.04,57.15 v66.04,78.74
  Bottom 0.254: IC5.13 v66.04,78.74 67.31,80.01 74.93,80.01 76.2,81.28 IC4.14 | IC7.19 81.28,57.15 80.01,55.88 74.93,55.88 73.66,57.15 v66.04,57.15 IC6.19 57.15,57.15 v52.07,52.07 | v87.63,53.34 102.87,53.34 104.14,52.07 IC9.6 | U$1.A17 6.35,49.53 13.97,49.53 16.51,46.99 v46.99,46.99
BUSD6  (via drill 0.61)
  Top 0.254: IC6.20 60.96,54.61 59.69,55.88 v59.69,67.31 59.69,74.93 58.42,76.2 IC5.12 | v88.9,50.8 85.09,54.61 IC7.20 | U$1.A16 3.81,49.53 v3.81,67.31
  Bottom 0.254: IC7.20 81.28,54.61 80.01,53.34 74.93,53.34 73.66,54.61 IC6.20 | v88.9,50.8 102.87,50.8 104.14,49.53 IC9.7 | v3.81,67.31 3.81,69.85 27.94,69.85 30.48,67.31 v59.69,67.31
BUSD7  (via drill 0.61)
  Top 0.254: IC6.21 60.96,52.07 58.42,54.61 v58.42,66.04 58.42,73.66 IC5.11 | v88.9,48.26 85.09,52.07 IC7.21
  Bottom 0.254: IC7.21 81.28,52.07 80.01,50.8 73.66,50.8 72.39,52.07 IC6.21 | v88.9,48.26 102.87,48.26 104.14,46.99 IC9.8 | U$1.A15 3.81,46.99 3.81,64.77 25.4,64.77 26.67,66.04 v58.42,66.04
CLKIRQ  (via drill 0.61)
  Top 0.254: v95.25,78.74 95.25,86.36 96.52,87.63 IC14.13
  Bottom 0.254: IC5.9 50.8,76.2 52.07,77.47 86.36,77.47 87.63,76.2 92.71,76.2 v95.25,78.74 104.14,78.74 106.68,81.28 114.3,81.28 115.57,82.55 IC13.9
CLKIRQEN  (via drill 0.61)
  Top 0.254: v113.03,77.47 v113.03,82.55 | v82.55,74.93 81.28,76.2 81.28,91.44 78.74,93.98 IC4.19
  Bottom 0.254: v113.03,82.55 115.57,85.09 IC13.10 | v113.03,77.47 111.76,76.2 93.98,76.2 92.71,74.93 v82.55,74.93 | IC5.3 50.8,91.44 52.07,92.71 73.66,92.71 74.93,93.98 IC4.19
CTS
  Bottom 0.254: IC15.13 135.89,41.91 138.43,39.37 151.13,39.37 152.4,38.1 152.4,33.02 153.67,33.02 X2.8
DCD
  Top 0.254: IC16.8 146.05,19.05 148.59,19.05 148.59,20.32 154.94,26.67 154.94,34.29 153.67,35.56 X2.9
DSR
  Bottom 0.254: IC16.13 135.89,24.13 137.16,22.86 149.86,22.86 153.67,26.67 X2.6 153.67,27.94
DTR  (via drill 0.61)
  Top 0.254: IC16.14 v133.35,31.75
  Bottom 0.254: v133.35,31.75 134.62,33.02 149.86,33.02 151.13,34.29 X2.4
GND  (via drill 0.61)
  Top 0.254: JP4.3 35.56,50.8 36.83,49.53 36.83,39.37 35.56,38.1 JP5.3 34.29,26.67 35.56,25.4 35.56,22.86 C10.2 | U$3.10 20.32,33.02 20.32,21.59 19.05,20.32 JP10.3 | U$1.C1 8.89,11.43 v8.89,21.59 | U$1.A32 U$1.A31 U$1.A30 U$1.A29 U$1.A28 | IC1.3 IC1.4 27.94,88.9 26.67,87.63 26.67,77.47 | 27.94,78.74 26.67,77.47 | 26.67,77.47 22.86,73.66 22.86,68.58 19.05,64.77 19.05,52.07 20.32,50.8 U$3.3 | 27.94,78.74 C7.2 | IC1.8 27.94,78.74 | v46.99,50.8 48.26,52.07 48.26,73.66 IC5.10 | v83.82,5.08 85.09,6.35 C17.2 | v64.77,8.89 67.31,8.89 67.31,17.78 C9.2 | IC9.19 IC9.20 106.68,16.51 106.68,7.62 | 144.78,5.08 149.86,10.16 U$2.3 152.4,11.43 X2.G1 152.4,21.59 154.94,24.13 154.94,25.4 156.21,26.67 156.21,41.91 | 144.78,5.08 QG1.7 | 144.78,5.08 144.78,20.32 143.51,21.59 IC16.10 | 123.19,20.32 124.46,21.59 C14.2 | 123.19,20.32 121.92,19.05 IC9.22 | 123.19,20.32 123.19,25.4 121.92,26.67 IC9.25 | v102.87,25.4 102.87,30.48 104.14,31.75 IC9.14 | C27.2 123.19,20.32 | IC6.16 77.47,69.85 80.01,72.39 80.01,77.47 78.74,78.74 | v69.85,62.23 IC4.10 | 62.23,96.52 C13.2 | 62.23,96.52 63.5,96.52 68.58,91.44 IC4.3 | 78.74,78.74 80.01,80.01 v80.01,90.17 | 78.74,78.74 IC4.13 | 133.35,63.5 C16.2 | 133.35,63.5 133.35,52.07 | 133.35,52.07 135.89,49.53 C3.+ | 139.7,88.9 139.7,73.66 133.35,67.31 133.35,63.5 | 139.7,88.9 C18.2 | 133.35,52.07 133.35,46.99 130.81,44.45 IC15.15 | IC7.16 100.33,62.23 102.87,64.77 102.87,69.85 107.95,74.93 107.95,80.01 IC13.7 | 152.4,57.15 146.05,57.15 IC11.7 | 152.4,57.15 153.67,57.15 154.94,58.42 IC3.8 | 156.21,41.91 151.13,36.83 X2.5 | 156.21,41.91 156.21,48.26 152.4,52.07 152.4,57.15 | 139.7,88.9 130.81,88.9 130.81,81.28 129.54,80.01 IC12.7
  Top 0.254: C20.2 v120.65,78.74 | v45.72,88.9 45.72,93.98 46.99,95.25 54.61,95.25 54.61,92.71 62.23,92.71 62.23,96.52 | 106.68,7.62 106.68,6.35 105.41,5.08 IC8.7 | 106.68,7.62 v101.6,7.62
  Bottom 0.254: 19.05,8.89 21.59,6.35 IC2.8 | 19.05,8.89 11.43,8.89 U$1.C1 U$1.A1 | 19.05,8.89 19.05,5.08 20.32,3.81 34.29,3.81 JP11.3 | C10.2 33.02,20.32 JP10.3 16.51,20.32 15.24,21.59 v8.89,21.59 | U$1.A32 U$1.C32 11.43,87.63 43.18,87.63 44.45,88.9 v45.72,88.9 | 12.7,76.2 11.43,77.47 6.35,77.47 U$1.A28 | 12.7,76.2 13.97,74.93 27.94,74.93 29.21,73.66 IC5.10 | C22.2 39.37,95.25 34.29,95.25 30.48,91.44 IC1.3 | 12.7,76.2 15.24,78.74 IC1.8 | JP4.3 v46.99,50.8 | v83.82,5.08 81.28,5.08 IC10.7 | v64.77,8.89 C23.2 | C9.2 68.58,21.59 88.9,21.59 C25.2 IC9.19 IC9.22 | v102.87,25.4 118.11,25.4 119.38,26.67 IC9.25 | C14.2 129.54,22.86 130.81,24.13 IC16.15 | QG1.7 139.7,5.08 C27.2 | IC6.16 v69.85,62.23 | IC4.8 IC4.13 87.63,78.74 88.9,77.47 IC14.8 | C20.2 119.38,91.44 104.14,91.44 C21.2 101.6,91.44 81.28,91.44 v80.01,90.17 74.93,90.17 73.66,91.44 | C12.2 81.28,93.98 80.01,92.71 74.93,92.71 73.66,91.44 | IC4.3 73.66,91.44 | C15.2 125.73,40.64 129.54,40.64 130.81,41.91 IC15.15 | C26.2 133.35,52.07 135.89,49.53 C3.+ | C19.2 156.21,93.98 143.51,93.98 142.24,92.71 C18.2 | 130.81,78.74 129.54,80.01 IC12.7 | 130.81,78.74 143.51,78.74 144.78,80.01 IC11.7 | 130.81,78.74 v120.65,78.74 111.76,78.74 110.49,80.01 IC13.7 | C17.2 86.36,7.62 v101.6,7.62
  Bottom 0.406: C8.- 8.89,5.08 U$1.C1
IOINH  (via drill 0.61)
  Top 0.254: v53.34,81.28 54.61,80.01 v54.61,71.12 | v73.66,71.12 v73.66,83.82 | v151.13,74.93 151.13,86.36 152.4,87.63 IC11.11 | v91.44,68.58 86.36,73.66 v86.36,82.55
  Bottom 0.254: v54.61,71.12 v73.66,71.12 | v53.34,81.28 IC5.7 | v73.66,83.82 IC4.15 85.09,83.82 v86.36,82.55 | v151.13,74.93 149.86,73.66 135.89,73.66 133.35,71.12 101.6,71.12 99.06,68.58 v91.44,68.58
LCTS  (via drill 0.61)
  Top 0.254: v134.62,53.34 137.16,50.8 137.16,46.99 138.43,45.72 IC15.12
  Bottom 0.254: v134.62,53.34 123.19,53.34 121.92,54.61 IC9.36
LDCD  (via drill 0.61)
  Top 0.254: v147.32,45.72 147.32,27.94 146.05,26.67 IC16.9
  Bottom 0.254: v147.32,45.72 133.35,59.69 IC9.38
LDSR  (via drill 0.61)
  Top 0.254: v134.62,49.53 134.62,46.99 135.89,46.99 137.16,45.72 137.16,27.94 138.43,26.67 IC16.12 | v130.81,50.8 v130.81,54.61
  Bottom 0.254: v134.62,49.53 133.35,50.8 v130.81,50.8 | v130.81,54.61 128.27,57.15 IC9.37
LDTR  (via drill 0.61)
  Top 0.254: v142.24,38.1 142.24,29.21 140.97,27.94 IC16.11
  Bottom 0.254: v142.24,38.1 118.11,38.1 118.11,45.72 119.38,46.99 IC9.33
LED  (via drill 0.61)
  Top 0.254: v53.34,86.36 54.61,85.09 60.96,85.09 v60.96,86.36 | v73.66,88.9 71.12,86.36 IC4.5
  Bottom 0.254: IC5.5 v53.34,86.36 | v60.96,86.36 IC4.5 | v73.66,88.9 74.93,87.63 80.01,87.63 81.28,86.36 125.73,86.36 127,85.09 IC12.5
LRTS
  Bottom 0.254: IC9.32 121.92,44.45 123.19,45.72 139.7,45.72 140.97,44.45 IC15.11
LRX
  Bottom 0.254: IC9.10 107.95,41.91 118.11,52.07 118.11,58.42 132.08,58.42 146.05,44.45 IC15.9
LTX  (via drill 0.61)
  Top 0.254: v143.51,29.21 144.78,30.48 144.78,40.64 143.51,41.91 IC15.10
  Bottom 0.254: v143.51,29.21 128.27,29.21 128.27,30.48 123.19,35.56 118.11,35.56 118.11,36.83 115.57,39.37 IC9.11
N$2  (via drill 0.61)
  Top 0.254: v72.39,27.94 72.39,29.21 IC6.3 | v66.04,21.59 v66.04,27.94 | v62.23,15.24 v62.23,20.32
  Bottom 0.254: v66.04,27.94 v72.39,27.94 | v66.04,21.59 64.77,20.32 v62.23,20.32 | v62.23,15.24 59.69,12.7 53.34,12.7 JP8.2
N$3
  Top 0.254: IC9.15 106.68,29.21 107.95,30.48 107.95,43.18 106.68,44.45 IC9.9
N$4
  Top 0.254: IC6.30 60.96,29.21 59.69,27.94 59.69,13.97 57.15,11.43 JP1.2
N$5
  Top 0.254: IC6.1 77.47,16.51 73.66,16.51 JP2.2
N$6
  Top 0.254: U$3.19 30.48,53.34 31.75,54.61 31.75,85.09 30.48,86.36 IC1.5
N$7  (via drill 0.61)
  Top 0.254: v80.01,67.31 80.01,52.07 82.55,49.53 IC7.22 | v96.52,69.85 101.6,74.93 v101.6,87.63
  Bottom 0.254: v80.01,67.31 81.28,68.58 90.17,68.58 91.44,69.85 v96.52,69.85 | v101.6,87.63 104.14,90.17 IC13.3
N$9
  Top 0.254: IC7.30 82.55,29.21 81.28,27.94 81.28,22.86 82.55,21.59 JP9.2
N$10  (via drill 0.61)
  Top 0.254: v25.4,16.51 25.4,12.7 24.13,11.43 IC2.6
  Bottom 0.254: v25.4,16.51 26.67,17.78 36.83,17.78 | 36.83,17.78 JP17.5 | JP18.2 43.18,16.51 41.91,17.78 36.83,17.78
N$11  (via drill 0.61)
  Top 0.254: v105.41,81.28 105.41,85.09 107.95,87.63 IC13.4
  Bottom 0.254: v105.41,81.28 95.25,81.28 93.98,80.01 IC14.7
N$12
  Top 0.254: JP14.5 44.45,5.08 43.18,3.81 40.64,3.81 40.64,5.08 JP13.2
  Bottom 0.254: JP13.2 33.02,7.62 31.75,8.89 IC2.10
N$13  (via drill 0.61)
  Top 0.254: v157.48,25.4 158.75,26.67 158.75,78.74 v157.48,80.01
  Bottom 0.254: v157.48,25.4 153.67,25.4 149.86,21.59 127,21.59 123.19,17.78 118.11,17.78 115.57,15.24 102.87,15.24 101.6,16.51 86.36,16.51 83.82,13.97 72.39,13.97 71.12,12.7 IC10.12 | v157.48,80.01 156.21,81.28 149.86,81.28 148.59,82.55 IC11.6
N$14  (via drill 0.61)
  Top 0.254: v72.39,6.35 72.39,7.62 76.2,7.62 78.74,5.08 IC10.6 | v62.23,6.35 60.96,7.62 v60.96,16.51
  Bottom 0.254: v62.23,6.35 v72.39,6.35 | v60.96,16.51 54.61,16.51 53.34,17.78 JP3.3
N$15  (via drill 0.61)
  Top 0.254: v72.39,24.13 72.39,16.51 73.66,15.24 IC10.11 | v69.85,24.13 67.31,26.67 67.31,27.94 64.77,30.48 58.42,30.48 | 58.42,30.48 JP3.1 | v55.88,27.94 58.42,30.48
  Bottom 0.254: 44.45,26.67 43.18,27.94 39.37,27.94 38.1,26.67 JP20.2 | v69.85,24.13 v72.39,24.13 | 44.45,26.67 45.72,27.94 v55.88,27.94 | 44.45,26.67 JP15.2
N$16  (via drill 0.61)
  Top 0.254: v24.13,26.67 24.13,24.13 IC2.1 | v35.56,26.67 35.56,35.56 36.83,36.83 36.83,38.1 43.18,44.45 44.45,44.45 44.45,35.56 45.72,34.29 v45.72,20.32
  Bottom 0.254: v24.13,26.67 v35.56,26.67 | v45.72,20.32 50.8,20.32 52.07,21.59 54.61,21.59 55.88,20.32 JP3.2
N$19
  Bottom 0.254: IC4.16 74.93,86.36 72.39,88.9 72.39,90.17 64.77,90.17 63.5,88.9 60.96,88.9 59.69,87.63 54.61,87.63 53.34,88.9 IC5.4
N$20
  Bottom 0.254: IC2.2 21.59,21.59 20.32,22.86 JP10.2
N$21
  Top 0.254: IC2.14 31.75,19.05 33.02,20.32 34.29,20.32 34.29,7.62 36.83,5.08 JP11.2
N$22  (via drill 0.61)
  Top 0.254: v15.24,26.67 15.24,17.78 16.51,16.51 JP12.1
  Bottom 0.254: JP12.1 IC2.4 | JP18.6 43.18,20.32 39.37,20.32 JP17.1 36.83,21.59 35.56,22.86 27.94,22.86 25.4,25.4 24.13,25.4 22.86,26.67 v15.24,26.67
N$23
  Top 0.254: 87.63,7.62 87.63,10.16 81.28,10.16 IC10.8 | 87.63,7.62 87.63,6.35 | 87.63,7.62 90.17,5.08 IC8.1
N$24
  Top 0.254: U$3.18 30.48,50.8 33.02,53.34 JP4.2
N$26  (via drill 0.61)
  Top 0.254: v100.33,82.55 100.33,91.44 99.06,92.71 IC14.15
  Bottom 0.254: v100.33,82.55 IC13.6
N$27  (via drill 0.61)
  Top 0.254: JP17.3 39.37,17.78 41.91,17.78 43.18,19.05 JP18.4 | 19.05,11.43 21.59,13.97 IC2.5 | v33.02,19.05 33.02,10.16 19.05,10.16 19.05,11.43 | JP12.3 19.05,11.43
  Bottom 0.254: v33.02,19.05 JP17.3
N$28
  Top 0.254: IC2.15 31.75,21.59 33.02,22.86 33.02,25.4 25.4,25.4 25.4,17.78 20.32,17.78 20.32,15.24 19.05,13.97 JP12.2
N$29  (via drill 0.61)
  Top 0.254: v119.38,90.17 119.38,81.28 118.11,80.01 IC13.8
  Bottom 0.254: v119.38,90.17 IC12.3
N$30  (via drill 0.61)
  Top 0.254: v43.18,5.08 43.18,8.89 JP14.3
  Bottom 0.254: IC2.11 36.83,11.43 JP13.4 39.37,11.43 43.18,11.43 JP14.3 | v43.18,5.08 66.04,5.08 IC10.1
N$31  (via drill 0.61)
  Top 0.254: R2.2 143.51,71.12 142.24,72.39 v142.24,82.55
  Bottom 0.254: v142.24,82.55 140.97,83.82 130.81,83.82 129.54,82.55 IC12.6
N$32
  Bottom 0.254: R2.1 156.21,53.34 LED1.K
N$33  (via drill 0.61)
  Top 0.254: v121.92,85.09 121.92,93.98 119.38,93.98 119.38,91.44 118.11,90.17 IC13.12 | v149.86,80.01 JP7.2
  Bottom 0.254: v121.92,85.09 125.73,81.28 133.35,81.28 | 133.35,81.28 134.62,82.55 IC12.9 | v149.86,80.01 148.59,81.28 133.35,81.28
N$34  (via drill 0.7)
  Top 0.254: IC7.29 85.09,31.75 86.36,30.48 86.36,21.59 87.63,20.32 v87.63,13.97
  Bottom 0.254: v87.63,13.97 96.52,13.97 97.79,12.7 IC8.11
N$35
  Bottom 0.254: IC12.11 137.16,87.63 138.43,86.36 151.13,86.36 152.4,85.09 IC11.10
N$36  (via drill 0.61)
  Top 0.254: v80.01,15.24 80.01,13.97 78.74,12.7 IC10.9
  Bottom 0.254: IC2.12 31.75,13.97 33.02,12.7 JP13.6 39.37,13.97 45.72,13.97 | v80.01,15.24 76.2,15.24 74.93,16.51 62.23,16.51 60.96,15.24 46.99,15.24 45.72,13.97 | 45.72,13.97 JP14.1
N$37  (via drill 0.61)
  Top 0.254: v114.3,77.47 114.3,91.44 115.57,92.71 IC13.13 | v157.48,16.51 157.48,24.13 156.21,25.4 157.48,26.67 157.48,48.26 156.21,49.53 v156.21,78.74
  Bottom 0.254: v114.3,77.47 149.86,77.47 151.13,78.74 v156.21,78.74 | v157.48,16.51 149.86,11.43 115.57,11.43 110.49,6.35 104.14,6.35 102.87,5.08 IC8.6
N$38
  Top 0.254: IC13.2 107.95,92.71 106.68,91.44 106.68,90.17 104.14,87.63 104.14,72.39 93.98,62.23 93.98,33.02 95.25,31.75 95.25,13.97 93.98,12.7 93.98,8.89 95.25,7.62 IC8.3
N$39  (via drill 0.61)
  Top 0.254: v142.24,27.94 QG1.8
  Bottom 0.254: v142.24,27.94 107.95,27.94 106.68,26.67 IC9.16
N$40
  Bottom 0.254: IC12.13 137.16,92.71 138.43,91.44 151.13,91.44 152.4,90.17 IC11.12
N$41
  Top 0.254: C1.- 132.08,33.02 133.35,34.29 IC15.3
N$42
  Top 0.254: C1.+ 129.54,33.02 128.27,34.29 IC15.1
N$43
  Top 0.254: C6.- 132.08,15.24 133.35,16.51 IC16.3
N$44
  Top 0.254: C6.+ 129.54,15.24 128.27,16.51 IC16.1
N$45
  Top 0.254: C2.- IC15.5
N$46
  Top 0.254: C2.+ IC15.4
N$47
  Top 0.254: C5.- IC16.5
N$48
  Top 0.254: C5.+ IC16.4
N$49
  Top 0.254: 139.7,33.02 139.7,20.32 140.97,19.05 IC16.6 | 139.7,33.02 140.97,34.29 IC15.6 | C3.- 139.7,46.99 139.7,33.02
N$50
  Top 0.254: IC16.2 130.81,19.05 129.54,20.32 129.54,27.94 130.81,29.21 IC15.2 130.81,36.83 129.54,38.1 C4.+
N$53  (via drill 0.61, 0.7)
  Top 0.254: R1.1 v121.92,6.35 | 48.26,78.74 IC5.8
  Top 0.305: v80.01,48.26 86.36,48.26 88.9,45.72 88.9,34.29 92.71,30.48 v92.71,21.59 | v115.57,20.32 115.57,5.08 R1.1
  Top 0.406: 48.26,78.74 46.99,78.74 v46.99,55.88 | v53.34,55.88 55.88,55.88 v55.88,52.07
  Bottom 0.254: v121.92,6.35 152.4,6.35 U$2.1
  Bottom 0.305: v92.71,21.59 93.98,20.32 v115.57,20.32
  Bottom 0.406: v46.99,55.88 v53.34,55.88 | v55.88,52.07 58.42,52.07 59.69,50.8 72.39,50.8 74.93,48.26 v80.01,48.26
N$54
  Bottom 0.254: IC3.4 144.78,50.8 151.13,50.8 158.75,43.18 158.75,1.27 99.06,1.27 97.79,2.54 | 97.79,2.54 96.52,1.27 72.39,1.27 71.12,2.54 IC10.3 | 97.79,2.54 IC8.4
N$71
  Top 0.254: U$3.9 22.86,35.56 24.13,36.83 24.13,39.37 22.86,40.64 U$3.7
  Bottom 0.254: JP5.2 U$3.14 U$3.7
N$74
  Top 0.254: IC3.12 JP7.1
N$75
  Top 0.254: IC3.10 JP7.3
PHI2  (via drill 0.61)
  Top 0.254: v109.22,68.58 109.22,53.34 102.87,53.34 101.6,52.07 v101.6,36.83 101.6,19.05 95.25,12.7 IC8.12 | v124.46,87.63 v124.46,68.58 | v113.03,88.9 113.03,93.98 111.76,95.25 IC13.1 107.95,95.25 107.95,93.98 87.63,93.98 83.82,90.17 83.82,77.47 v82.55,76.2 | v59.69,80.01 60.96,78.74 v60.96,76.2
  Bottom 0.254: U$1.C26 8.89,74.93 2.54,74.93 2.54,81.28 3.81,82.55 26.67,82.55 27.94,83.82 IC1.6 30.48,83.82 31.75,82.55 40.64,82.55 41.91,81.28 45.72,81.28 46.99,80.01 v59.69,80.01 | v124.46,68.58 v109.22,68.58 | v124.46,87.63 123.19,88.9 v113.03,88.9 | v101.6,36.83 IC9.12 | v60.96,76.2 62.23,74.93 81.28,74.93 v82.55,76.2
R/-W  (via drill 0.61)
  Top 0.254: U$1.C25 13.97,74.93 13.97,82.55 IC1.1 | v114.3,93.98 111.76,96.52 83.82,96.52 v83.82,95.25 | v73.66,96.52 v73.66,93.98
  Bottom 0.254: IC11.1 143.51,95.25 142.24,93.98 v114.3,93.98 | v83.82,95.25 74.93,95.25 v73.66,93.98 | v73.66,96.52 72.39,97.79 31.75,97.79 30.48,96.52 IC1.1
RTS  (via drill 0.61)
  Top 0.254: v134.62,31.75 134.62,40.64 133.35,41.91 IC15.14
  Bottom 0.254: v134.62,31.75 142.24,31.75 143.51,30.48 153.67,30.48 X2.7
RX
  Top 0.254: IC15.8 146.05,29.21 144.78,27.94 144.78,22.86 148.59,22.86 148.59,26.67 151.13,29.21 X2.2
S$1
  Top 2: 20,-1 -1,-1 -1,20
S$2
  Top 2: 140,-1 161,-1 161,20
S$3
  Top 2: 20,101 -1,101 -1,80
S$4
  Top 2: 161,80 161,101 140,101
S$5
  Bottom 2: 20,-1 -1,-1 -1,20
S$6
  Bottom 2: 140,-1 161,-1 161,20
S$7
  Bottom 2: 20,101 -1,101 -1,80
S$8
  Bottom 2: 161,80 161,101 140,101
TX  (via drill 0.61)
  Top 0.254: v143.51,31.75 IC15.7
  Bottom 0.254: v143.51,31.75 X2.3
UARTINT  (via drill 0.61)
  Top 0.254: v118.11,76.2 118.11,40.64 119.38,39.37 IC9.30
  Bottom 0.254: v118.11,76.2 154.94,76.2 158.75,80.01 158.75,91.44 156.21,91.44 154.94,92.71 IC11.13
UARTRES  (via drill 0.61)
  Top 0.254: v129.54,50.8 129.54,77.47 132.08,80.01 v132.08,87.63
  Bottom 0.254: v129.54,50.8 123.19,50.8 121.92,52.07 IC9.35 | v132.08,87.63 133.35,88.9 143.51,88.9 144.78,87.63 IC11.4
VBUF  (via drill 0.61)  (1 unrouted)
  Top 0.254: v34.29,6.35 29.21,1.27 6.35,1.27 6.35,11.43 U$1.A2 | v72.39,34.29 72.39,33.02 | v52.07,33.02 v52.07,35.56 | v44.45,33.02 39.37,27.94 39.37,20.32 36.83,20.32 v36.83,6.35
  Bottom 0.254: v34.29,6.35 v36.83,6.35 | v72.39,34.29 71.12,35.56 v52.07,35.56 | v44.45,33.02 v52.07,33.02
VCC  (via drill 0.61, 0.7)
  Top 0.254: C27.1 QG1.1 QG1.14 127,25.4 | 127,25.4 C14.1 124.46,31.75 v123.19,33.02 125.73,35.56 125.73,41.91 | 127,25.4 IC16.16 | IC9.39 IC9.40 | 125.73,41.91 128.27,41.91 IC15.16 128.27,49.53 | 125.73,41.91 C15.1 | 128.27,49.53 128.27,50.8 C26.1 v124.46,62.23 | 128.27,49.53 130.81,49.53 C4.- 132.08,54.61 130.81,55.88 130.81,66.04 C16.1 | JP1.1 JP8.1 | IC6.31 IC6.32 63.5,24.13 C9.1 63.5,12.7 C23.1 | C7.1 30.48,55.88 U$3.20 27.94,55.88 26.67,54.61 26.67,49.53 | 26.67,49.53 26.67,46.99 27.94,45.72 U$3.16 | JP21.3 12.7,5.08 11.43,6.35 11.43,11.43 U$1.C2 U$1.C3 | 31.75,36.83 30.48,35.56 U$3.12 | 31.75,36.83 31.75,41.91 33.02,43.18 JP5.1 34.29,49.53 26.67,49.53 | C10.1 34.29,25.4 33.02,26.67 33.02,35.56 31.75,36.83 | v26.67,15.24 27.94,16.51 27.94,22.86 29.21,24.13 IC2.16 | IC1.16 C22.1 44.45,96.52 | C13.1 58.42,96.52 IC5.20 IC5.1 44.45,96.52 | IC4.20 C12.1 | C19.1 IC11.14 152.4,95.25 151.13,93.98 151.13,87.63 148.59,85.09 148.59,62.23 149.86,60.96 IC3.6 | IC13.14 C20.1 | C21.1 IC14.16 | v40.64,57.15 44.45,60.96 44.45,96.52 | R1.2 v107.95,8.89 | v87.63,24.13 87.63,21.59 88.9,20.32 C25.1 88.9,16.51 90.17,15.24 IC8.14
  Top 0.406: C8.+ 11.43,6.35
  Bottom 0.254: R1.2 115.57,10.16 QG1.14 | C16.1 IC3.16 137.16,66.04 138.43,64.77 146.05,64.77 149.86,60.96 IC3.6 149.86,52.07 156.21,52.07 LED1.A | v123.19,33.02 115.57,33.02 114.3,34.29 IC9.13 | v124.46,62.23 IC9.39 | IC10.14 C23.1 59.69,8.89 JP1.1 | C9.1 64.77,17.78 71.12,17.78 JP2.1 | U$3.16 U$3.5 | U$3.20 JP4.1 35.56,55.88 36.83,57.15 v40.64,57.15 | IC2.16 C10.1 35.56,24.13 36.83,22.86 48.26,22.86 49.53,24.13 IC6.32 | U$1.C3 v26.67,15.24 | 114.3,96.52 115.57,95.25 IC13.14 | 104.14,96.52 114.3,96.52 | 104.14,96.52 C21.1 | 114.3,96.52 133.35,96.52 134.62,95.25 IC12.14 C18.1 140.97,96.52 151.13,96.52 152.4,95.25 IC11.14 | C12.1 104.14,96.52 | C13.1 62.23,95.25 73.66,95.25 74.93,96.52 IC4.20 | C17.1 IC8.14 90.17,10.16 91.44,8.89 v107.95,8.89 | v87.63,24.13 IC7.32
W/-R  (via drill 0.61, 0.7)
  Top 0.254: v143.51,72.39 143.51,91.44 144.78,92.71 IC11.2 | v110.49,69.85 v110.49,45.72 v110.49,8.89 | v93.98,6.35 92.71,7.62 IC8.13
  Bottom 0.254: IC6.24 63.5,44.45 64.77,43.18 80.01,43.18 81.28,44.45 IC7.24 86.36,44.45 87.63,43.18 107.95,43.18 v110.49,45.72 | v143.51,72.39 140.97,69.85 v110.49,69.85 | v110.49,8.89 109.22,7.62 104.14,7.62 102.87,6.35 v93.98,6.35

## Text on the board
Top: CSA BIOS V3.0D | (C) A. Fachat